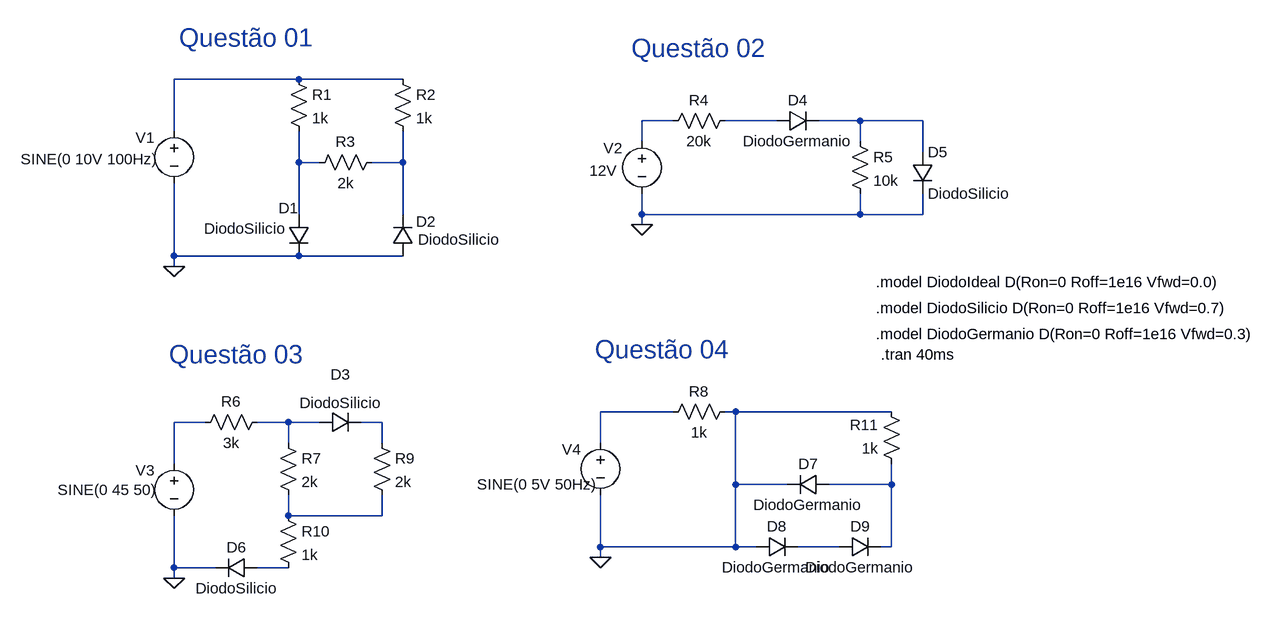
[diagram p0: schematic P1A12-Circuitos5-LTSpice.asc]
P1A12-Circuitos5-LTSpice.asc, the LTspice schematic file:
Version 4
SHEET 1 2300 1300
WIRE 160 -80 -32 -80
WIRE 320 -80 160 -80
WIRE 736 -16 688 -16
WIRE 896 -16 816 -16
WIRE 1024 -16 960 -16
WIRE 1120 -16 1024 -16
WIRE -32 0 -32 -80
WIRE 688 16 688 -16
WIRE 1024 16 1024 -16
WIRE 1120 32 1120 -16
WIRE 160 48 160 0
WIRE 192 48 160 48
WIRE 320 48 320 0
WIRE 320 48 272 48
WIRE 160 128 160 48
WIRE 320 128 320 48
WIRE 688 128 688 96
WIRE 1024 128 1024 96
WIRE 1024 128 688 128
WIRE 1120 128 1120 96
WIRE 1120 128 1024 128
WIRE 688 144 688 128
WIRE -32 192 -32 80
WIRE 160 192 -32 192
WIRE 320 192 160 192
WIRE -32 208 -32 192
WIRE 736 432 624 432
WIRE 832 432 816 432
WIRE 1072 432 832 432
WIRE 16 448 -32 448
WIRE 144 448 96 448
WIRE 192 448 144 448
WIRE 288 448 256 448
WIRE 144 480 144 448
WIRE 288 480 288 448
WIRE 624 480 624 432
WIRE -32 512 -32 448
WIRE 832 544 832 432
WIRE 912 544 832 544
WIRE 1072 544 1072 512
WIRE 1072 544 976 544
WIRE 144 592 144 560
WIRE 288 592 288 560
WIRE 288 592 144 592
WIRE 624 640 624 560
WIRE 832 640 832 544
WIRE 832 640 624 640
WIRE 864 640 832 640
WIRE 992 640 928 640
WIRE 1072 640 1072 544
WIRE 1072 640 1056 640
WIRE 624 656 624 640
WIRE -32 672 -32 592
WIRE 32 672 -32 672
WIRE 144 672 96 672
WIRE -32 688 -32 672
FLAG 688 144 0
FLAG -32 208 0
FLAG 624 656 0
FLAG -32 688 0
SYMBOL voltage -32 -16 R0
WINDOW 123 0 0 Left 2
WINDOW 39 0 0 Left 2
WINDOW 0 -59 26 Left 2
WINDOW 3 -236 59 Left 2
SYMATTR InstName V1
SYMATTR Value SINE(0 10V 100Hz)
SYMBOL res 144 -96 R0
SYMATTR InstName R1
SYMATTR Value 1k
SYMBOL res 304 -96 R0
SYMATTR InstName R2
SYMATTR Value 1k
SYMBOL res 128 464 R0
SYMATTR InstName R7
SYMATTR Value 2k
SYMBOL diode 336 192 R180
WINDOW 0 -35 53 Left 2
WINDOW 3 -133 25 Left 2
SYMATTR InstName D2
SYMATTR Value DiodoSilicio
SYMBOL voltage 688 0 R0
WINDOW 123 0 0 Left 2
WINDOW 39 0 0 Left 2
WINDOW 0 -59 26 Left 2
WINDOW 3 -81 61 Left 2
SYMATTR InstName V2
SYMATTR Value 12V
SYMBOL res 832 -32 R90
WINDOW 0 0 56 VBottom 2
WINDOW 3 32 56 VTop 2
SYMATTR InstName R4
SYMATTR Value 20k
SYMBOL res 176 64 R270
WINDOW 0 32 56 VTop 2
WINDOW 3 0 56 VBottom 2
SYMATTR InstName R3
SYMATTR Value 2k
SYMBOL diode 896 0 R270
WINDOW 0 32 32 VTop 2
WINDOW 3 0 32 VBottom 2
SYMATTR InstName D4
SYMATTR Value DiodoGermanio
SYMBOL voltage -32 496 R0
WINDOW 123 0 0 Left 2
WINDOW 39 0 0 Left 2
WINDOW 0 -59 26 Left 2
WINDOW 3 -179 56 Left 2
SYMATTR InstName V3
SYMATTR Value SINE(0 45 50)
SYMBOL res 1008 0 R0
SYMATTR InstName R5
SYMATTR Value 10k
SYMBOL res 112 432 R90
WINDOW 0 0 56 VBottom 2
WINDOW 3 32 56 VTop 2
SYMATTR InstName R6
SYMATTR Value 3k
SYMBOL diode 1104 32 R0
SYMATTR InstName D5
SYMATTR Value DiodoSilicio
SYMBOL voltage 624 464 R0
WINDOW 123 0 0 Left 2
WINDOW 39 0 0 Left 2
WINDOW 0 -59 26 Left 2
WINDOW 3 -190 80 Left 2
SYMATTR InstName V4
SYMATTR Value SINE(0 5V 50Hz)
SYMBOL res 128 576 R0
SYMATTR InstName R10
SYMATTR Value 1k
SYMBOL diode 144 128 R0
WINDOW 0 -15 -10 Left 2
WINDOW 3 -130 22 Left 2
SYMATTR InstName D1
SYMATTR Value DiodoSilicio
SYMBOL diode 192 464 R270
WINDOW 0 74 32 VTop 2
WINDOW 3 61 32 VBottom 2
SYMATTR InstName D3
SYMATTR Value DiodoSilicio
SYMBOL res 272 464 R0
SYMATTR InstName R9
SYMATTR Value 2k
SYMBOL diode 96 656 R90
WINDOW 0 0 32 VBottom 2
WINDOW 3 32 32 VTop 2
SYMATTR InstName D6
SYMATTR Value DiodoSilicio
SYMBOL res 832 416 R90
WINDOW 0 0 56 VBottom 2
WINDOW 3 32 56 VTop 2
SYMATTR InstName R8
SYMATTR Value 1k
SYMBOL res 1088 528 R180
WINDOW 0 36 76 Left 2
WINDOW 3 36 40 Left 2
SYMATTR InstName R11
SYMATTR Value 1k
SYMBOL diode 976 528 R90
WINDOW 0 0 32 VBottom 2
WINDOW 3 32 32 VTop 2
SYMATTR InstName D7
SYMATTR Value DiodoGermanio
SYMBOL diode 864 656 R270
WINDOW 0 32 32 VTop 2
WINDOW 3 0 32 VBottom 2
SYMATTR InstName D8
SYMATTR Value DiodoGermanio
SYMBOL diode 992 656 R270
WINDOW 0 32 32 VTop 2
WINDOW 3 0 32 VBottom 2
SYMATTR InstName D9
SYMATTR Value DiodoGermanio
TEXT 1048 232 Left 2 !.model DiodoIdeal D(Ron=0 Roff=1e16 Vfwd=0.0)
TEXT 1048 272 Left 2 !.model DiodoSilicio D(Ron=0 Roff=1e16 Vfwd=0.7)
TEXT -24 -144 Left 4 ;Questão 01
TEXT 1048 312 Left 2 !.model DiodoGermanio D(Ron=0 Roff=1e16 Vfwd=0.3)
TEXT 672 -128 Left 4 ;Questão 02
TEXT -40 344 Left 4 ;Questão 03
TEXT 616 336 Left 4 ;Questão 04
TEXT 1056 344 Left 2 !.tran 40ms

The netlist it stands for:
* P1A12-Circuitos5-LTSpice.asc
V1 N001 0 SINE(0 10V 100Hz)
R1 N001 N005 1k
R2 N001 N006 1k
R7 N009 N012 2k
D2 0 N006 DiodoSilicio
V2 N002 0 12V
R4 N003 N002 20k
R3 N005 N006 2k
D4 N003 N004 DiodoGermanio
V3 N008 0 SINE(0 45 50)
R5 N004 0 10k
R6 N009 N008 3k
D5 N004 0 DiodoSilicio
V4 N007 0 SINE(0 5V 50Hz)
R10 N012 N014 1k
D1 N005 0 DiodoSilicio
D3 N009 N010 DiodoSilicio
R9 N010 N012 2k
D6 N014 0 DiodoSilicio
R8 0 N007 1k
R11 N011 0 1k
D7 N011 0 DiodoGermanio
D8 0 N013 DiodoGermanio
D9 N013 N011 DiodoGermanio
.model D D
.lib standard.dio
.model DiodoIdeal D(Ron=0 Roff=1e16 Vfwd=0.0)
.model DiodoSilicio D(Ron=0 Roff=1e16 Vfwd=0.7)
* Questão 01
.model DiodoGermanio D(Ron=0 Roff=1e16 Vfwd=0.3)
* Questão 02
* Questão 03
* Questão 04
.tran 40ms
.backanno
.end